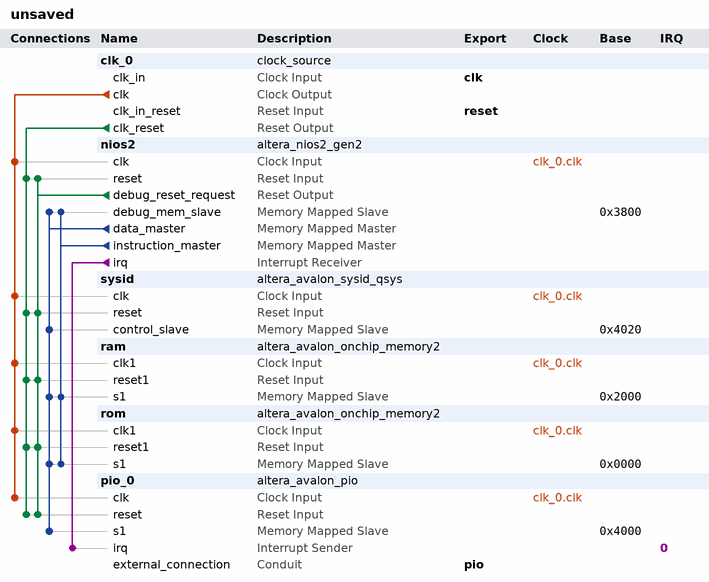
[diagram p0: system contents]
# Platform Designer (Qsys) system unsaved, Cyclone IV E EP4CE10F17C8
# Parameters at their usual value, and those the tool derives, are not listed.
package require -exact qsys 18.1
create_system unsaved
set_project_property DEVICE_FAMILY {Cyclone IV E}
set_project_property DEVICE EP4CE10F17C8

add_instance clk_0 clock_source 18.1
set_instance_parameter_value clk_0 clockFrequency 50000000

add_instance nios2 altera_nios2_gen2 18.1
set_instance_parameter_value nios2 dcache_size 2048
set_instance_parameter_value nios2 debug_datatrigger 4
set_instance_parameter_value nios2 debug_hwbreakpoint 4
set_instance_parameter_value nios2 debug_traceType instruction_and_data_trace
set_instance_parameter_value nios2 exceptionSlave ram.s1
set_instance_parameter_value nios2 icache_size 4096
set_instance_parameter_value nios2 impl Fast
set_instance_parameter_value nios2 resetSlave rom.s1

add_instance sysid altera_avalon_sysid_qsys 18.1
set_instance_parameter_value sysid id 305210181

add_instance ram altera_avalon_onchip_memory2 18.1
set_instance_parameter_value ram dataWidth 32
set_instance_parameter_value ram dualPort false
set_instance_parameter_value ram initMemContent true
set_instance_parameter_value ram initializationFileName onchip_mem.hex
set_instance_parameter_value ram memorySize 4096

add_instance rom altera_avalon_onchip_memory2 18.1
set_instance_parameter_value rom dataWidth 32
set_instance_parameter_value rom dualPort false
set_instance_parameter_value rom initMemContent true
set_instance_parameter_value rom initializationFileName onchip_mem.hex
set_instance_parameter_value rom memorySize 4096
set_instance_parameter_value rom writable false

add_instance pio_0 altera_avalon_pio 18.1
set_instance_parameter_value pio_0 bitModifyingOutReg true
set_instance_parameter_value pio_0 captureEdge true
set_instance_parameter_value pio_0 direction Bidir
set_instance_parameter_value pio_0 generateIRQ true
set_instance_parameter_value pio_0 irqType EDGE
set_instance_parameter_value pio_0 resetValue 31
set_instance_parameter_value pio_0 width 5

# connections
add_connection clk_0.clk nios2.clk clock
add_connection clk_0.clk pio_0.clk clock
add_connection clk_0.clk ram.clk1 clock
add_connection clk_0.clk rom.clk1 clock
add_connection clk_0.clk sysid.clk clock
add_connection clk_0.clk_reset nios2.reset reset
add_connection clk_0.clk_reset pio_0.reset reset
add_connection clk_0.clk_reset ram.reset1 reset
add_connection clk_0.clk_reset rom.reset1 reset
add_connection clk_0.clk_reset sysid.reset reset
add_connection nios2.debug_reset_request nios2.reset reset
add_connection nios2.debug_reset_request pio_0.reset reset
add_connection nios2.debug_reset_request ram.reset1 reset
add_connection nios2.debug_reset_request rom.reset1 reset
add_connection nios2.debug_reset_request sysid.reset reset
add_connection nios2.data_master nios2.debug_mem_slave avalon
set_connection_parameter_value nios2.data_master/nios2.debug_mem_slave baseAddress 0x3800
add_connection nios2.data_master pio_0.s1 avalon
set_connection_parameter_value nios2.data_master/pio_0.s1 baseAddress 0x4000
add_connection nios2.data_master ram.s1 avalon
set_connection_parameter_value nios2.data_master/ram.s1 baseAddress 0x2000
add_connection nios2.data_master rom.s1 avalon
set_connection_parameter_value nios2.data_master/rom.s1 baseAddress 0x0000
add_connection nios2.data_master sysid.control_slave avalon
set_connection_parameter_value nios2.data_master/sysid.control_slave baseAddress 0x4020
add_connection nios2.instruction_master nios2.debug_mem_slave avalon
set_connection_parameter_value nios2.instruction_master/nios2.debug_mem_slave baseAddress 0x3800
add_connection nios2.instruction_master ram.s1 avalon
set_connection_parameter_value nios2.instruction_master/ram.s1 baseAddress 0x2000
add_connection nios2.instruction_master rom.s1 avalon
set_connection_parameter_value nios2.instruction_master/rom.s1 baseAddress 0x0000
add_connection nios2.irq pio_0.irq interrupt
set_connection_parameter_value nios2.irq/pio_0.irq irqNumber 0

# exported interfaces
add_interface clk clock sink
set_interface_property clk EXPORT_OF clk_0.clk_in
add_interface pio conduit end
set_interface_property pio EXPORT_OF pio_0.external_connection
add_interface reset reset sink
set_interface_property reset EXPORT_OF clk_0.clk_in_reset

set_interconnect_requirement {$system} qsys_mm.clockCrossingAdapter HANDSHAKE
set_interconnect_requirement {$system} qsys_mm.enableEccProtection FALSE
set_interconnect_requirement {$system} qsys_mm.insertDefaultSlave FALSE
set_interconnect_requirement {$system} qsys_mm.maxAdditionalLatency 1

save_system unsaved.qsys
